# Altium project TK103_Multiplexer.PrjPCB
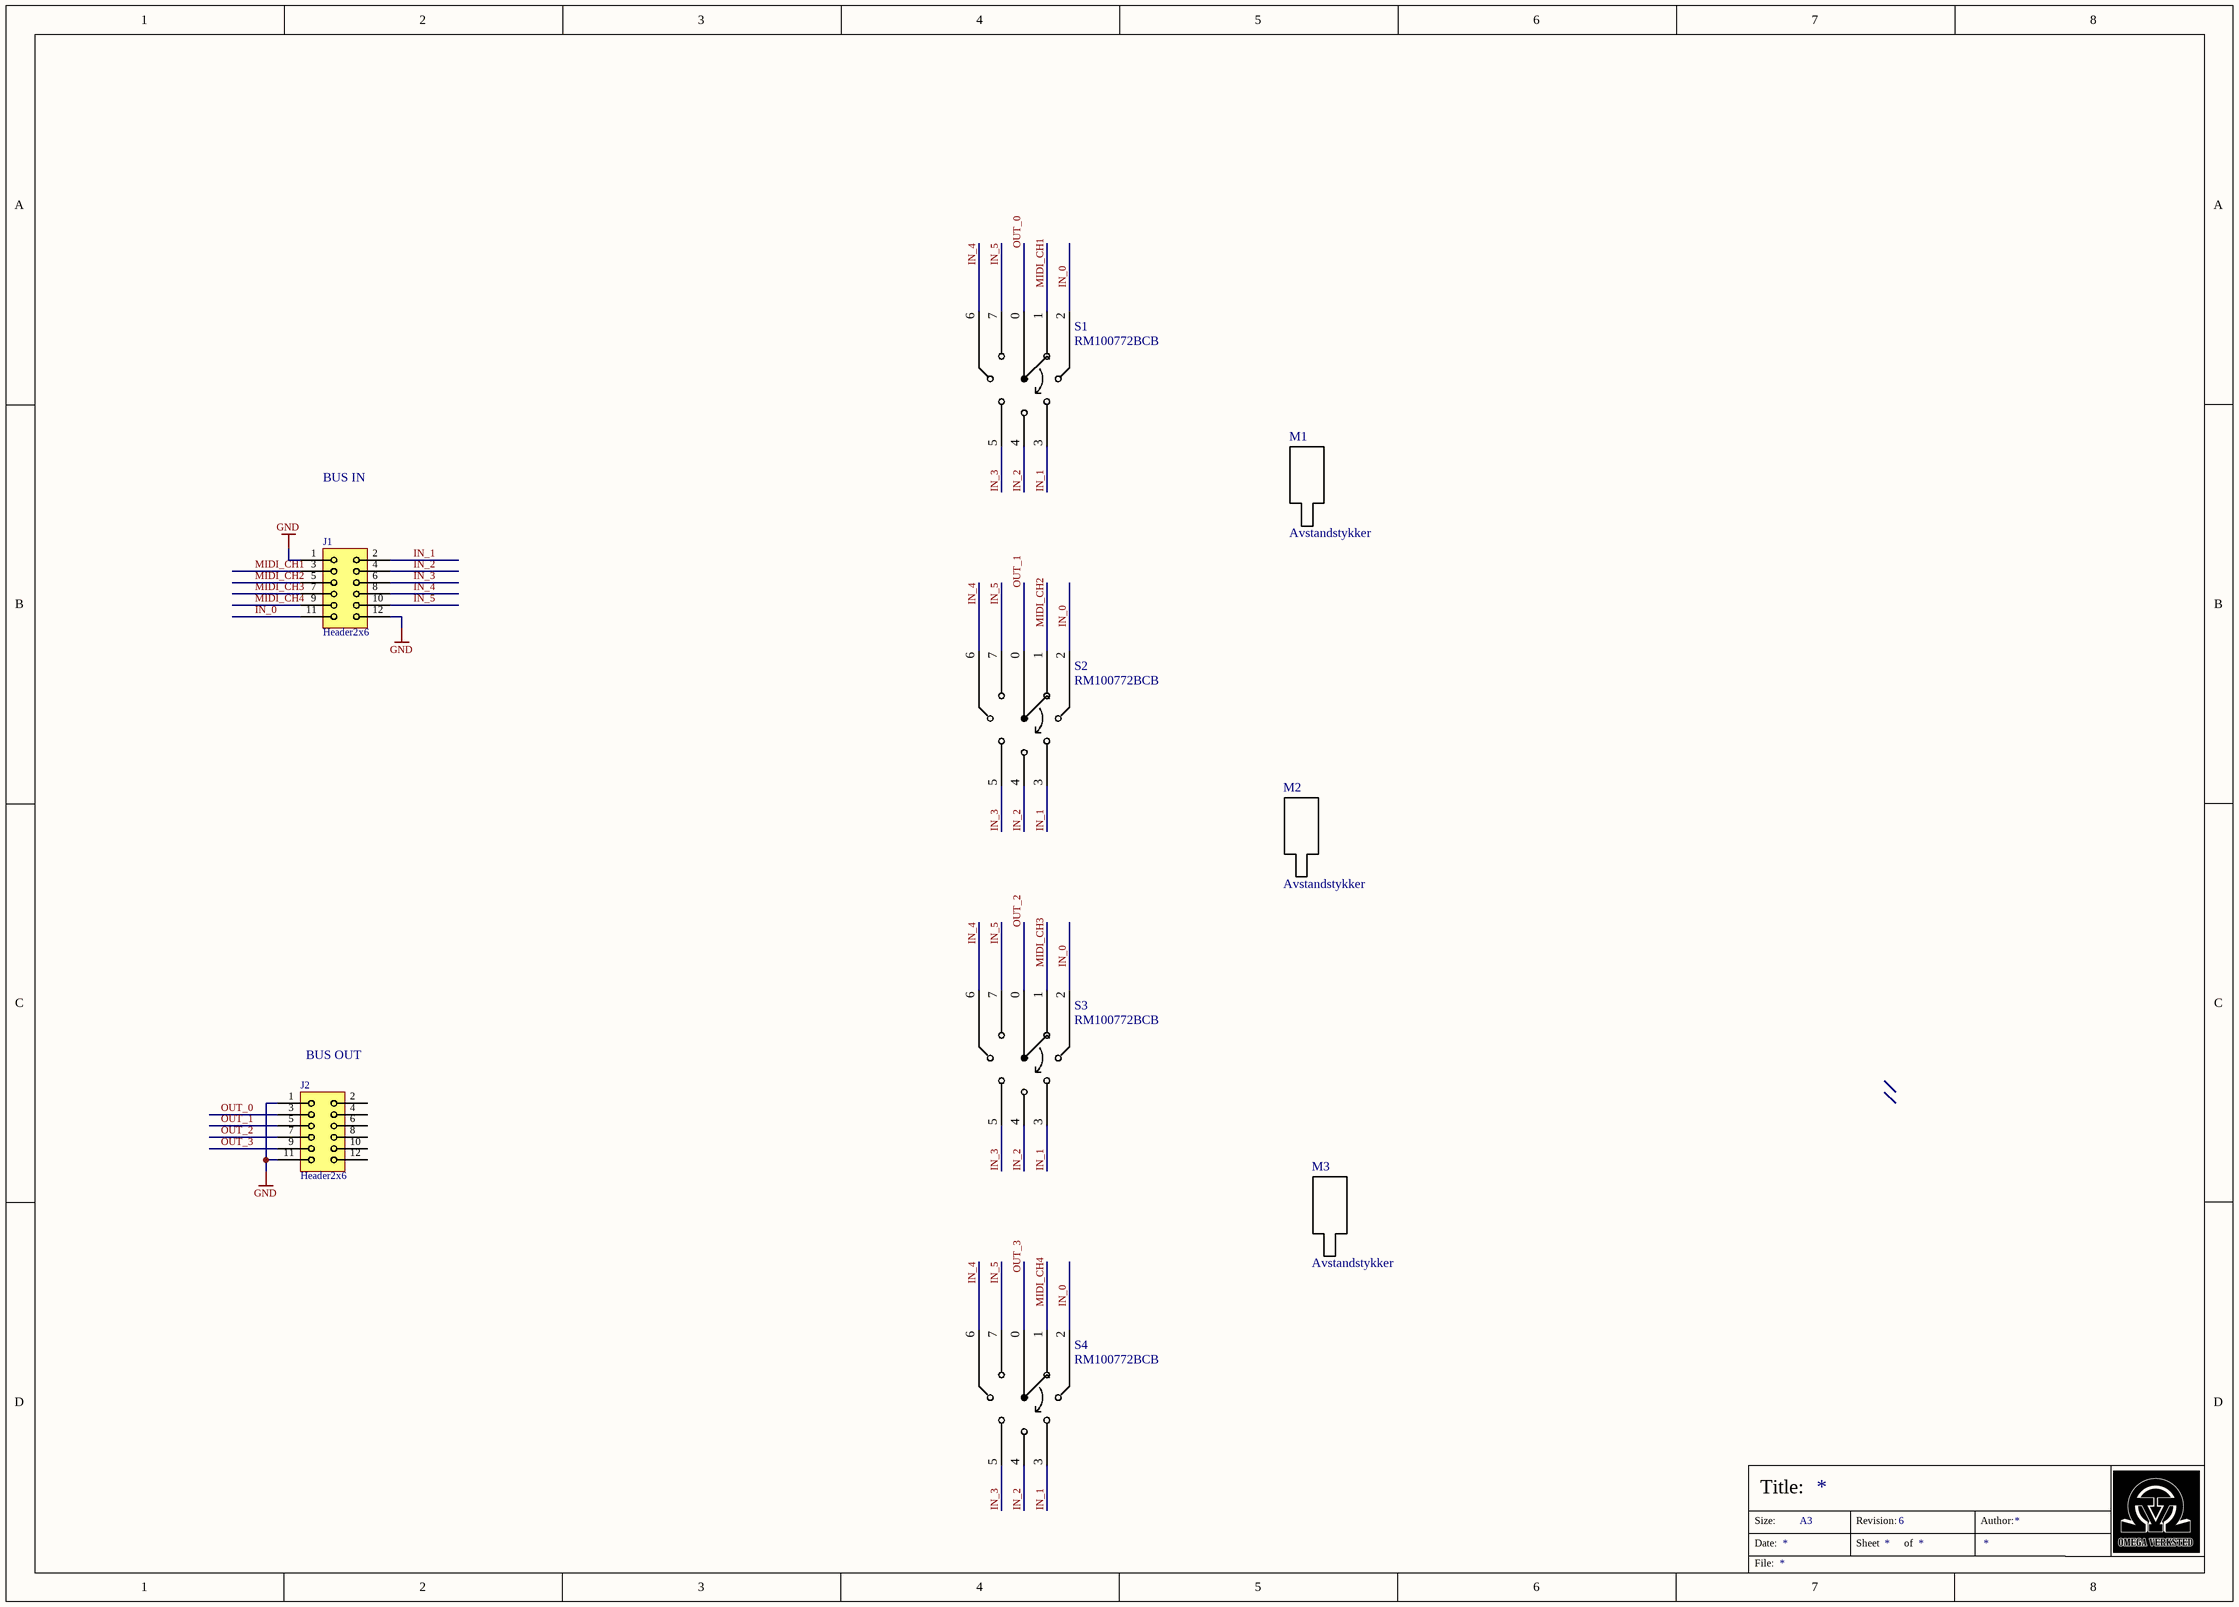
[diagram p0: TK103_Multiplexer.SchDoc]
1 sheet, 9 parts. Net scope: global (net labels, ports and power ports of the same name join across sheets).
Board file: TK103_Multiplexer.PcbDoc

## Sheet TK103_Multiplexer.SchDoc
size A3; Revision: 6

### Parts
J1  Header2x6  [HDRV12W64P254_2X6_Shrouded]
J2  Header2x6  [HDRV12W64P254_2X6_Shrouded]
M1  Avstandstykker  [M3_Spacer_Inverted]
M2  Avstandstykker  [M3_Spacer_Inverted]
M3  Avstandstykker  [M3_Spacer_Inverted]
S1  RM100772BCB  [RM100772BCB]
S2  RM100772BCB  [RM100772BCB]
S3  RM100772BCB  [RM100772BCB]
S4  RM100772BCB  [RM100772BCB]

### Nets
GND: J1.1 J1.12 J2.1 J2.11
IN_0: J1.11 S1.2 S2.2 S3.2 S4.2
IN_1: J1.2 S1.3 S2.3 S3.3 S4.3
IN_2: J1.4 S1.4 S2.4 S3.4 S4.4
IN_3: J1.6 S1.5 S2.5 S3.5 S4.5
IN_4: J1.8 S1.6 S2.6 S3.6 S4.6
IN_5: J1.10 S1.7 S2.7 S3.7 S4.7
MIDI_CH1: J1.3 S1.1
MIDI_CH2: J1.5 S2.1
MIDI_CH3: J1.7 S3.1
MIDI_CH4: J1.9 S4.1
OUT_0: J2.3 S1.0
OUT_1: J2.5 S2.0
OUT_2: J2.7 S3.0
OUT_3: J2.9 S4.0

Not connected (* = marked no-connect by the designer): J2 2 4 6 8 10 12

### Notes on the sheet
- BUS IN
- (near J2) BUS OUT
- Size:
- Date:
- Title:
- A3
- Revision:
- Sheet
- of
- Author:
- File:

### Library data of the parts
J1 J2 = 4650: id: 4650; pakke_opprettet_av: 815; beskrivelse: Header Shrouded; navn: Header 2X6 Shrouded; pris: 16; nokkelord: Header; pakketype: TH; pakke_opprettet: 2019-02-16 14:00:24; symbol_opprettet_av: 815; symbol_opprettet: 2014-11-13 11:04:02
M1-M3 = 1713: M3 Hex Threaded Nylon Spacer; id: 1713; rad: 2; rom: OV; lager_type: Fremlager; dybde: 0; hylle: 5; antall: 300; pakke_opprettet_av: 815; leverandor_varenr: 1733429; pris: 1; leverandor: Farnell; pakke_opprettet: 2019-02-17 15:22:28; symbol_opprettet_av: 815; symbol_opprettet: 2019-02-17 15:24:27; navn: Avstandstykker; pakketype: -
S1-S4 = 4656: SWITCH ROTARY 8POS 500MA 24V; id: 4656; pakke_opprettet_av: 815; leverandor_varenr: CKN10691-ND; pris: 25; nokkelord: RM; produsent: C&K; leverandor: DigiKey; pakketype: TH; pakke_opprettet: 2019-02-17 14:24:57; symbol_opprettet_av: 815; symbol_opprettet: 2019-02-17 14:24:21; navn: RM100772BCB